# Altium schematic sheet Title Page.SchDoc
size A3; SheetNumber: 1; SheetTotal: 2
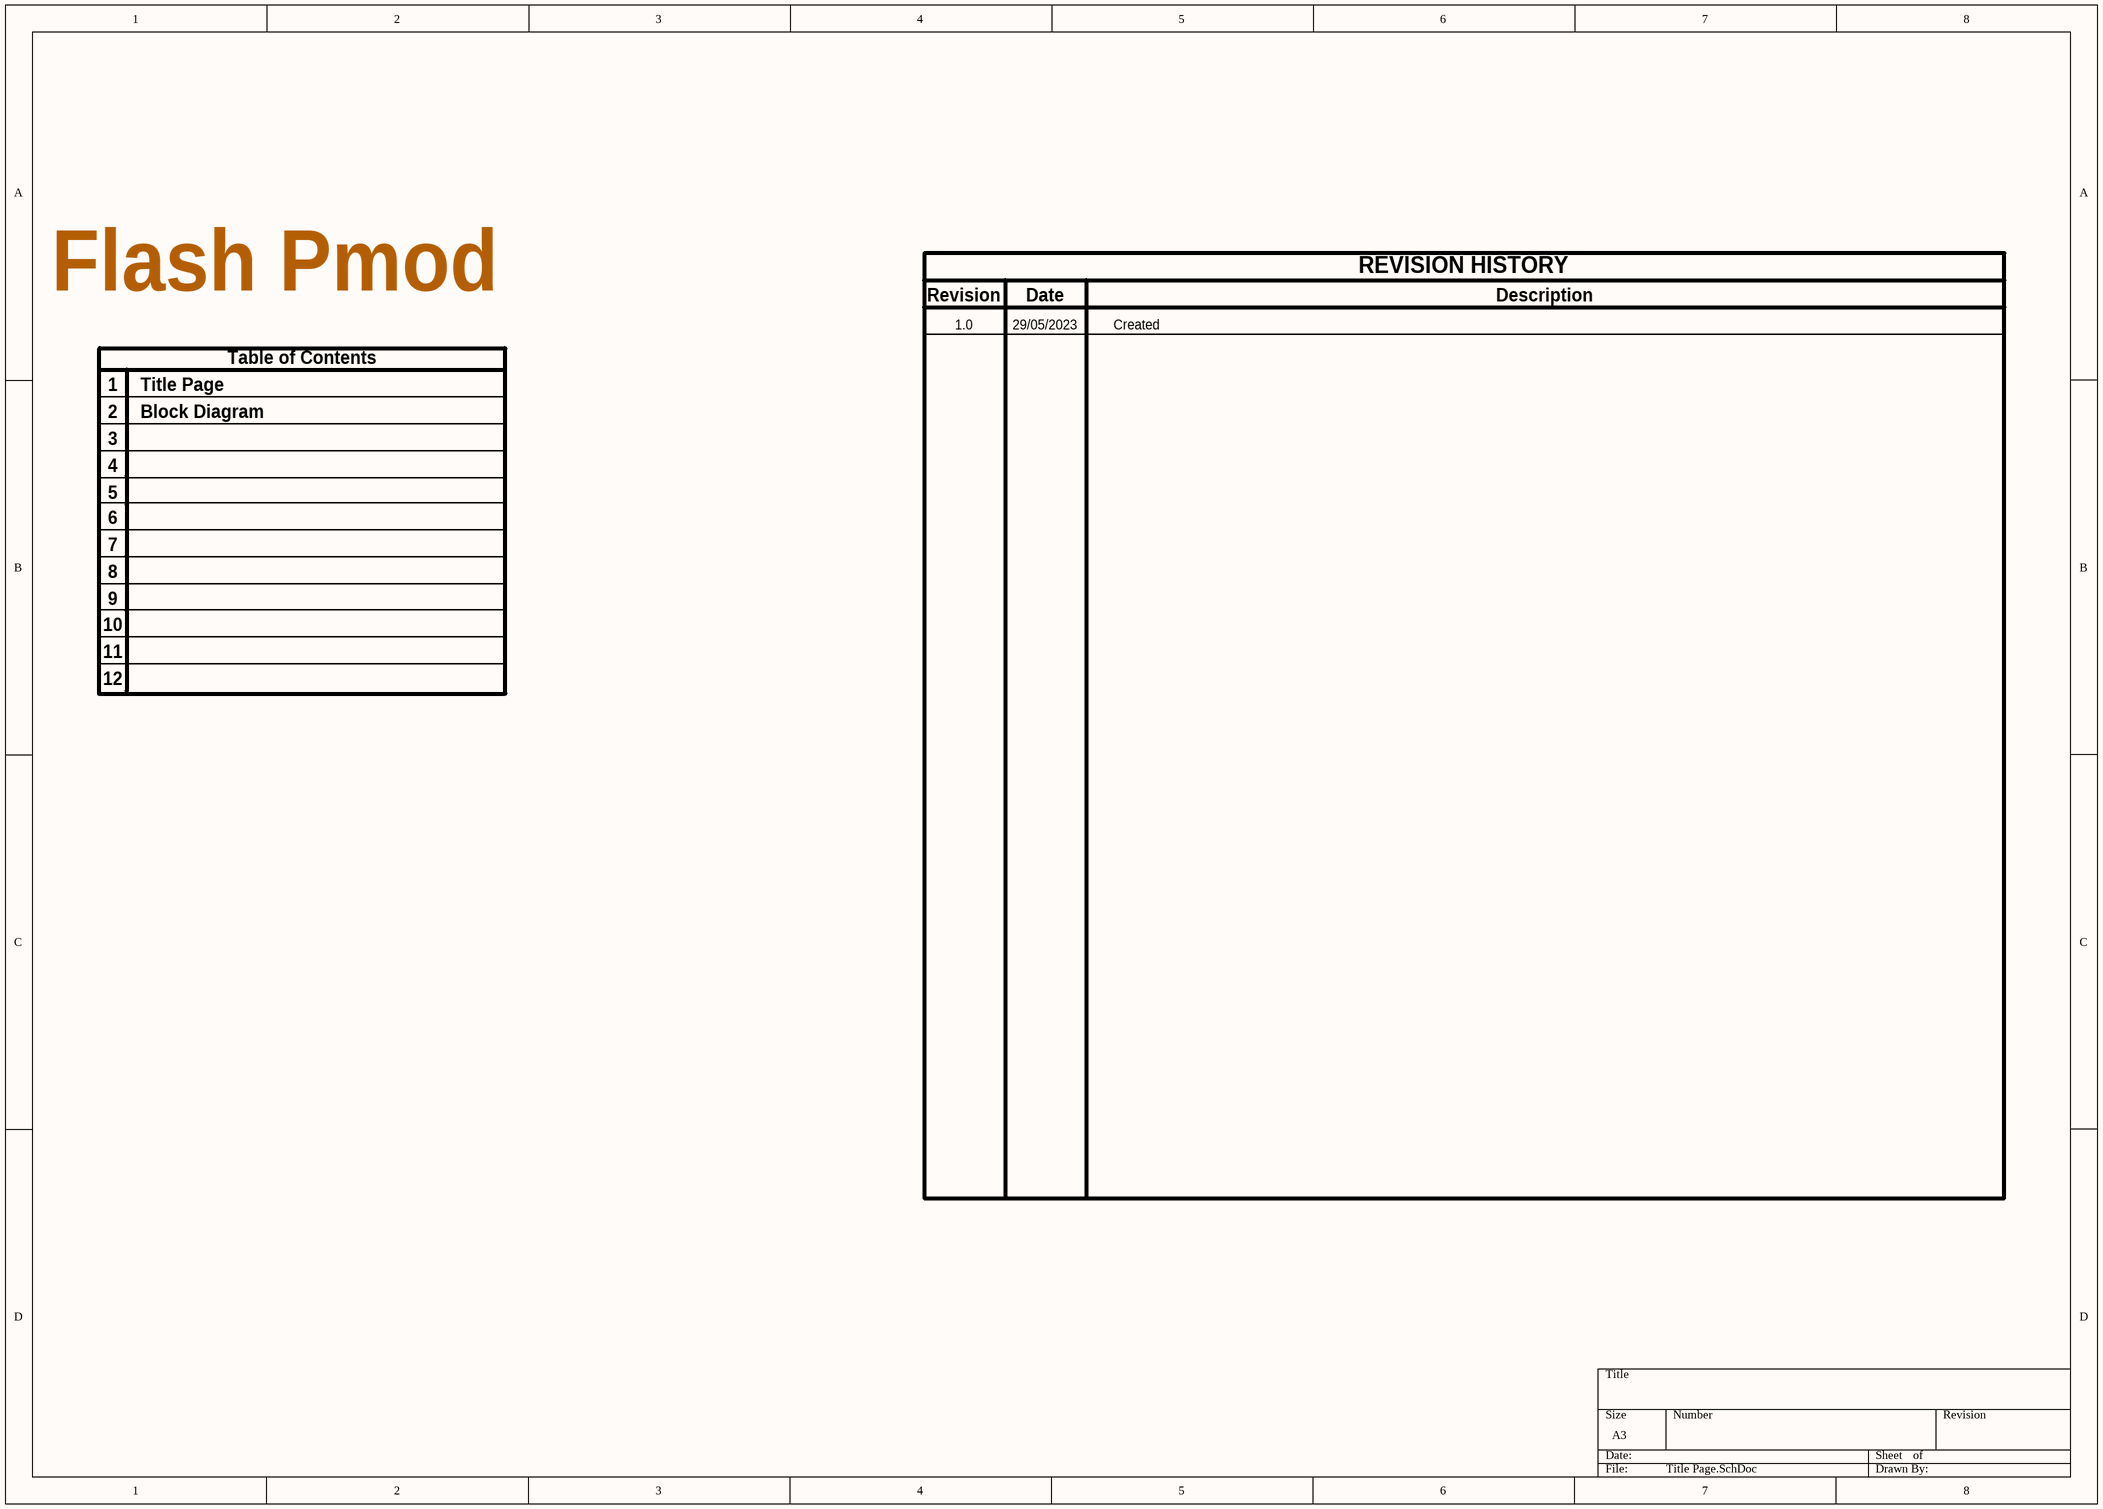
[diagram p0: Title Page.SchDoc]

## Notes on the sheet
- Flash Pmod
- Revision
- Date
- REVISION HISTORY
- Description
- Table of Contents
- 1.0
- 29/05/2023
- Created
- 1
- 2
- 3
- Title Page
- Block Diagram
- 4
- 5
- 6
- 7
- 8
- 9
- 10
- 11
- 12